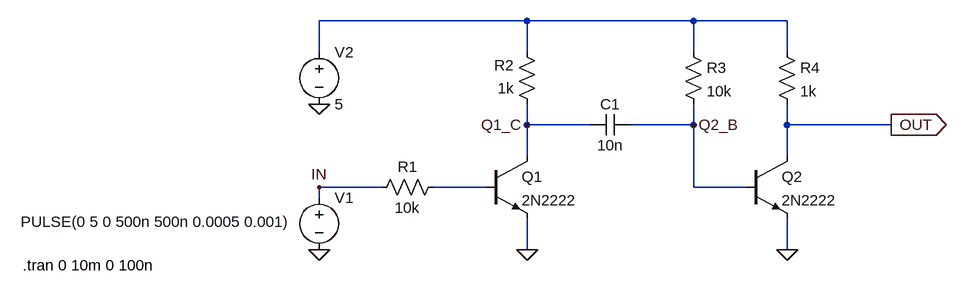
[diagram p0: schematic pulse_gen_1.asc]
pulse_gen_1.asc, the LTspice schematic file:
Version 4
SHEET 1 880 680
WIRE 160 -48 -160 -48
WIRE 416 -48 160 -48
WIRE 560 -48 416 -48
WIRE -160 0 -160 -48
WIRE 160 0 160 -48
WIRE 416 0 416 -48
WIRE 560 0 560 -48
WIRE 160 112 160 80
WIRE 256 112 160 112
WIRE 416 112 416 80
WIRE 416 112 320 112
WIRE 560 112 560 80
WIRE 720 112 560 112
WIRE 160 160 160 112
WIRE 560 160 560 112
WIRE -64 208 -160 208
WIRE 96 208 16 208
WIRE 416 208 416 112
WIRE 496 208 416 208
WIRE -160 224 -160 208
WIRE 160 304 160 256
WIRE 560 304 560 256
FLAG 160 304 0
FLAG -160 304 0
FLAG -160 80 0
FLAG 560 304 0
FLAG 720 112 OUT
IOPIN 720 112 Out
FLAG -160 208 IN
FLAG 160 112 Q1_C
FLAG 416 112 Q2_B
SYMBOL npn 96 160 R0
SYMATTR InstName Q1
SYMATTR Value 2N2222
SYMBOL res 32 192 R90
WINDOW 0 0 56 VBottom 2
WINDOW 3 32 56 VTop 2
SYMATTR InstName R1
SYMATTR Value 10k
SYMBOL res 176 96 R180
WINDOW 0 36 76 Left 2
WINDOW 3 36 40 Left 2
SYMATTR InstName R2
SYMATTR Value 1k
SYMBOL voltage -160 208 R0
WINDOW 3 -459 53 Left 2
WINDOW 123 0 0 Left 0
WINDOW 39 0 0 Left 0
SYMATTR InstName V1
SYMATTR Value PULSE(0 5 0 500n 500n 0.0005 0.001)
SYMBOL voltage -160 -16 R0
WINDOW 123 0 0 Left 0
WINDOW 39 0 0 Left 0
SYMATTR InstName V2
SYMATTR Value 5
SYMBOL cap 320 96 R90
WINDOW 0 0 32 VBottom 2
WINDOW 3 32 32 VTop 2
SYMATTR InstName C1
SYMATTR Value 10n
SYMBOL res 400 -16 R0
SYMATTR InstName R3
SYMATTR Value 10k
SYMBOL npn 496 160 R0
SYMATTR InstName Q2
SYMATTR Value 2N2222
SYMBOL res 544 -16 R0
SYMATTR InstName R4
SYMATTR Value 1k
TEXT -616 328 Left 2 !.tran 0 10m 0 100n

The netlist it stands for:
* pulse_gen_1.asc
Q1 Q1_C N002 0 0 2N2222
R1 N002 IN 10k
R2 Q1_C N001 1k
V1 IN 0 PULSE(0 5 0 500n 500n 0.0005 0.001)
V2 N001 0 5
C1 Q2_B Q1_C 10n
R3 N001 Q2_B 10k
Q2 OUT Q2_B 0 0 2N2222
R4 N001 OUT 1k
.model NPN NPN
.model PNP PNP
.lib standard.bjt
.tran 0 10m 0 100n
.backanno
.end